# EAGLE design ltc1043-chop-mux (EAGLE 7.7.0)
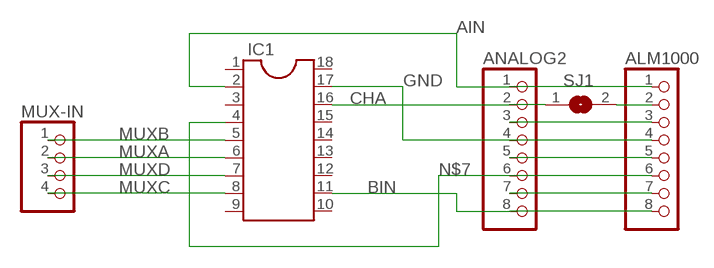
[diagram p0: schematic, sheet 1]

## Parts
ALM1000  PINHD-1X8  [1X08]
ANALOG2  PINHD-1X8  [1X08]
IC1  DIL18  [DIL18]
MUX-IN  PINHD-1X4  [1X04]
SJ1  SJ  [SJ]

## Nets
AIN: ALM1000.1 ANALOG2.1 IC1.2
BIN: ALM1000.8 ANALOG2.8 IC1.11
CHA: ANALOG2.2 IC1.16 SJ1.1
GND: ALM1000.4 ANALOG2.4 IC1.17
MUXA: IC1.6 MUX-IN.2
MUXB: IC1.5 MUX-IN.1
MUXC: IC1.8 MUX-IN.4
MUXD: IC1.7 MUX-IN.3
N$1: ALM1000.2 SJ1.2
N$6: ALM1000.7 ANALOG2.7
N$7: ALM1000.6 ANALOG2.6 IC1.4
N$8: ALM1000.5 ANALOG2.5
N$10: ALM1000.3 ANALOG2.3
Unconnected: IC1.1 IC1.3 IC1.9 IC1.10 IC1.12 IC1.13 IC1.14 IC1.15 IC1.18

## Library data of the parts
ALM1000 ANALOG2 = pinhead:PINHD-1X8: PIN HEADER
IC1 = ic-package:DIL18: Dual In Line / Socket
MUX-IN = pinhead:PINHD-1X4: PIN HEADER
SJ1 = jumper:SJ: SMD solder JUMPER

## Board
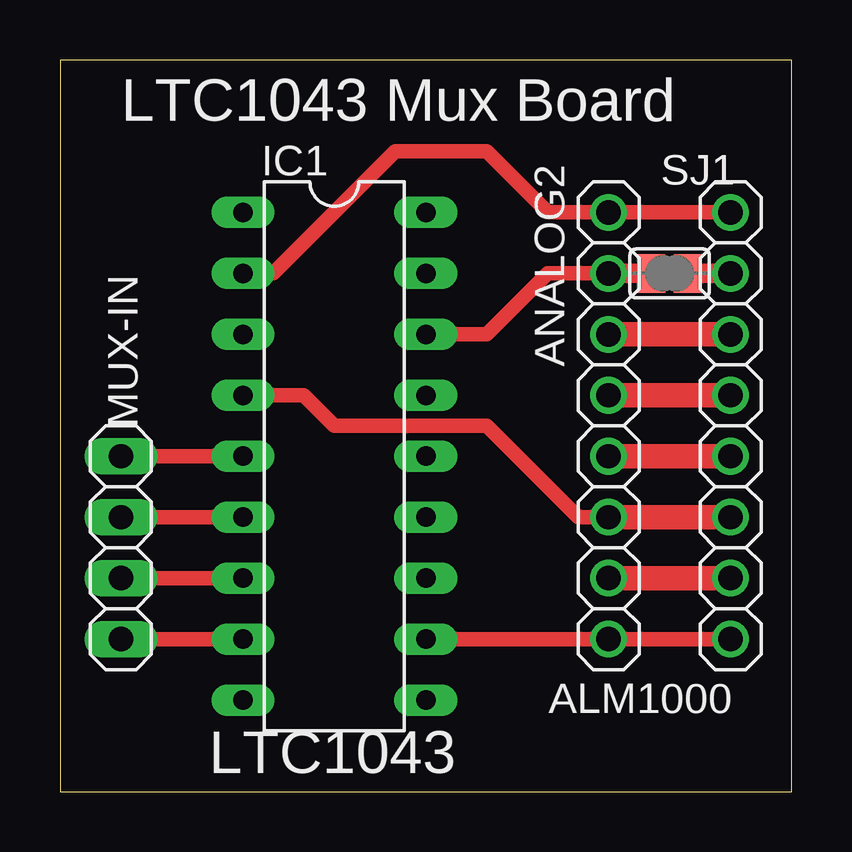
[diagram p1: board, top side]
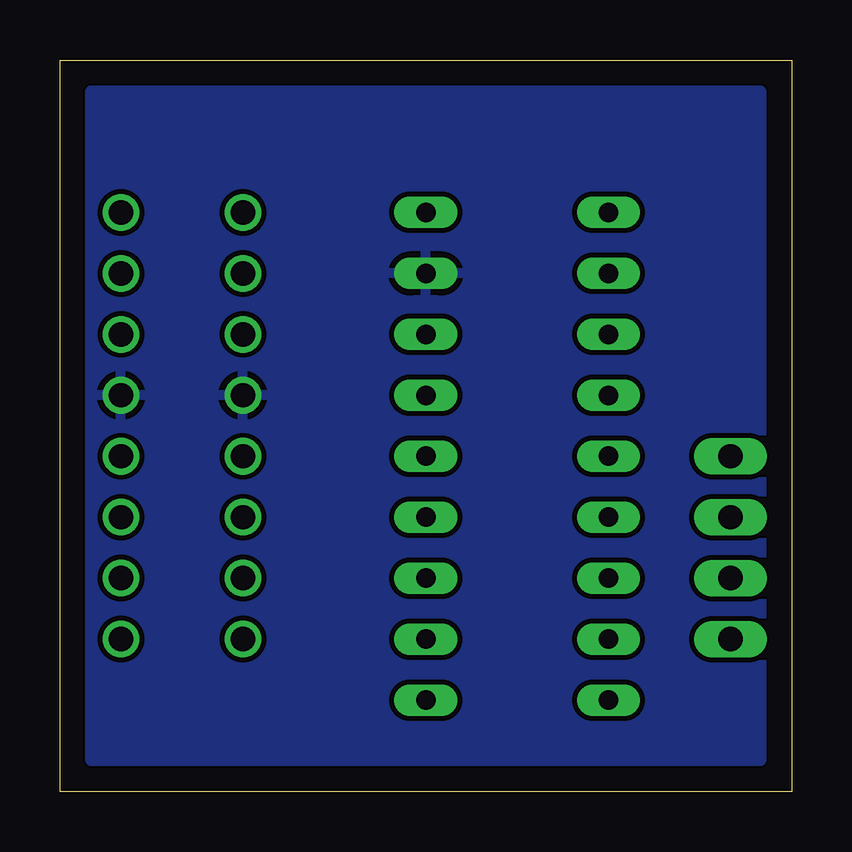
[diagram p2: board, bottom side, seen from below]

Size 30.48 x 30.48 mm. Coordinates in mm from the lower left corner, seen from the top.
Outline: 0,0 30.48,0 30.48,30.48 0,30.48 0,0
Copper layers (1*16): Top 0.035mm / dielectric 1.5mm / Bottom 0.035mm
Design rules "default": minimum track width 10mil, minimum drill 24mil, track to track 8mil, track to pad 8mil, pad to pad 8mil, via to via 8mil, smd to smd 8mil, copper to edge 40mil, drill to drill 8mil, minimum pad ring 10mil, minimum via ring 8mil, stop-mask expansion 4mil, vias tented up to drill 0mil, thermal gap 10mil

### Footprints (pad centres in the part's own frame; a part is rotated, then mirrored left to right if it is on the bottom)
1X08 = drill 1.016: 1 -8.89,0; 2 -6.35,0; 3 -3.81,0; 4 -1.27,0; 5 1.27,0; 6 3.81,0; 7 6.35,0; 8 8.89,0
DIL18 = drill 0.813 long: 1 -10.16,-3.81; 2 -7.62,-3.81; 3 -5.08,-3.81; 4 -2.54,-3.81; 5 0,-3.81; 6 2.54,-3.81; 7 5.08,-3.81; 8 7.62,-3.81; 9 10.16,-3.81; 10 10.16,3.81; 11 7.62,3.81; 12 5.08,3.81; 13 2.54,3.81; 14 0,3.81; 15 -2.54,3.81; 16 -5.08,3.81; 17 -7.62,3.81; 18 -10.16,3.81
1X04 = drill 1.016 long: 1 -3.81,0; 2 -1.27,0; 3 1.27,0; 4 3.81,0
SJ = smd 1.168 x 1.6: 1 -0.762,0; 2 0.762,0

### Placement (x,y rotation side)
ALM1000  27.94,15.24 270 top
ANALOG2  22.86,15.24 270 top
IC1  11.43,13.97 270 top
MUX-IN  2.54,10.16 270 top
SJ1  25.4,21.59 0 top

### Tracks (layer width: path | path; a pad name or v marks a point on that pad's centre or on a via)
AIN
  Top 0.61: ALM1000.1 ANALOG2.1 20.32,24.13 17.78,26.67 13.97,26.67 8.89,21.59 IC1.2
BIN
  Top 0.61: ALM1000.8 ANALOG2.8 IC1.11
CHA
  Top 0.61: ANALOG2.2 20.32,21.59 17.78,19.05 IC1.16
  Top 0.813: SJ1.1 ANALOG2.2
GND
  Top 1.016: ALM1000.4 ANALOG2.4
  pour Bottom: 1.27,1.27 29.21,1.27 29.21,29.21 1.27,29.21
MUXA
  Top 0.61: IC1.6 MUX-IN.2
MUXB
  Top 0.61: IC1.5 MUX-IN.1
MUXC
  Top 0.61: IC1.8 MUX-IN.4
MUXD
  Top 0.61: IC1.7 MUX-IN.3
N$1
  Top 0.813: ALM1000.2 SJ1.2
N$6
  Top 1.016: ALM1000.7 ANALOG2.7
N$7
  Top 0.61: ANALOG2.6 21.59,11.43 17.78,15.24 11.43,15.24 10.16,16.51 IC1.4
  Top 1.016: ALM1000.6 ANALOG2.6
N$8
  Top 1.016: ALM1000.5 ANALOG2.5
N$10
  Top 1.016: ALM1000.3 ANALOG2.3

### Text on the board
tPlace: LTC1043 Mux Board | LTC1043